# Altium schematic sheet Flash.SchDoc
size 420 x 297 mm
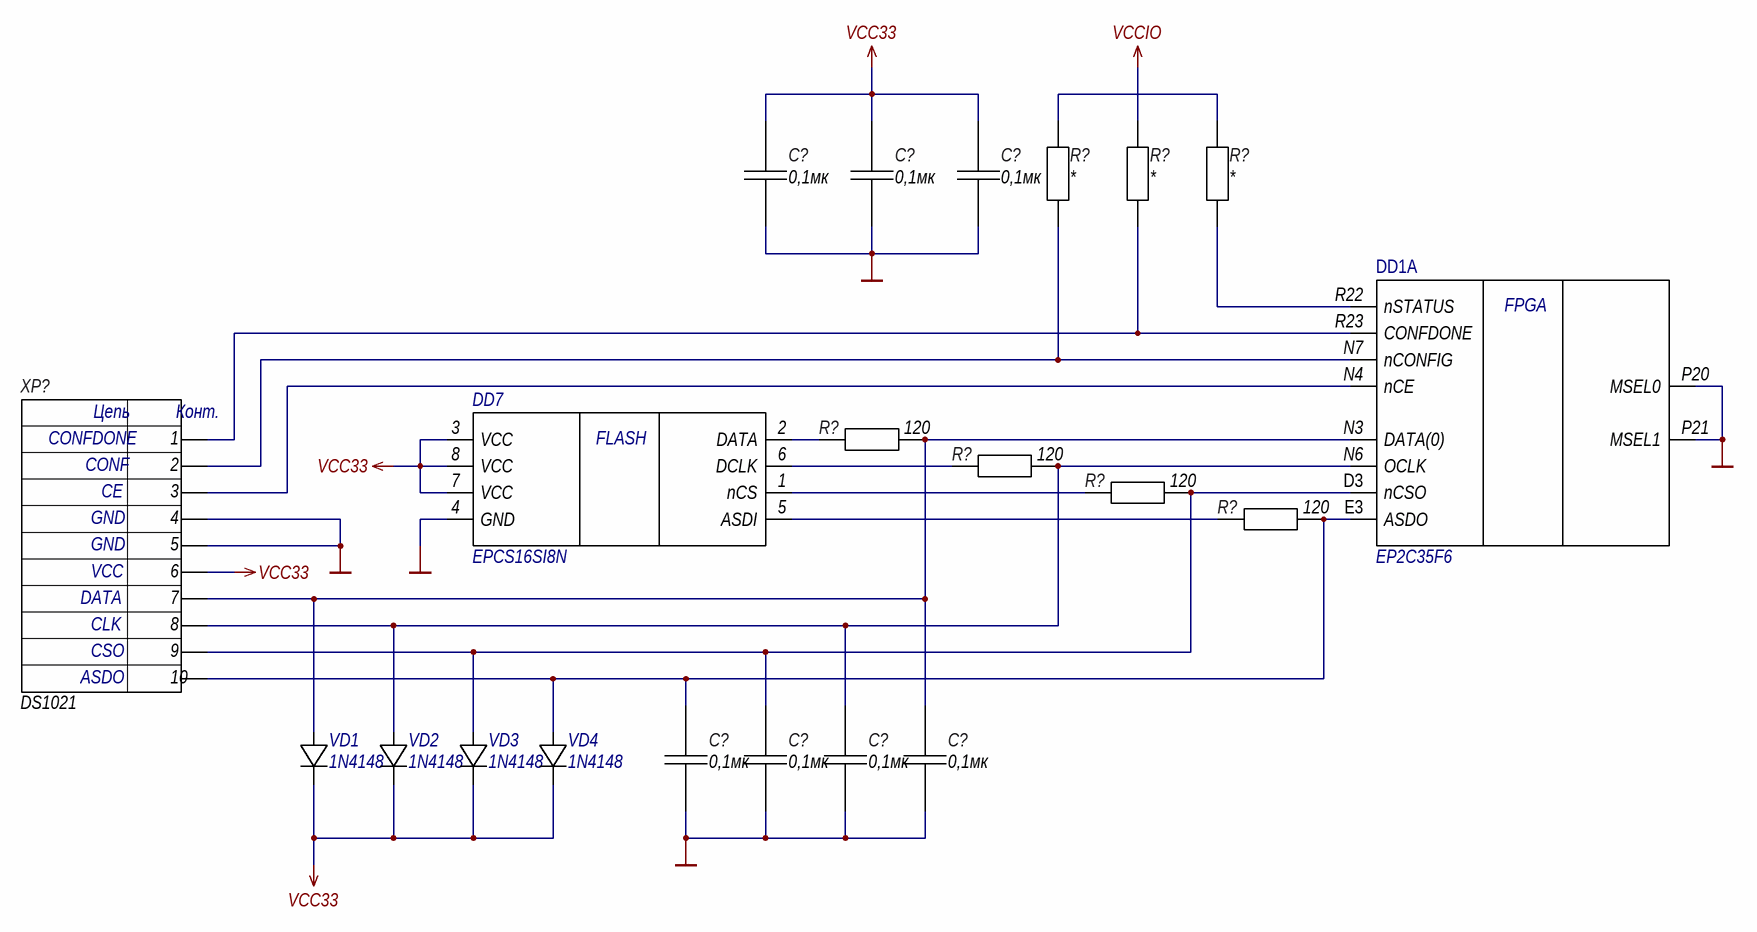
[diagram p0: Flash.SchDoc]

## Parts
(Parts that share a designator on the sheet are numbered #1, #2 ... from top to bottom, then left to right.)
C?#1  0,1мк  [ECPU1C154MA5]
C?#2  0,1мк  [ECPU1C154MA5]
C?#3  0,1мк  [ECPU1C154MA5]
C?#4  0,1мк  [ECPU1C154MA5]
C?#5  0,1мк  [ECPU1C154MA5]
C?#6  0,1мк  [ECPU1C154MA5]
C?#7  0,1мк  [ECPU1C154MA5]
DD1  EP2C35F6  [BGA672CP100_26X26_2700X2700X240B60N]  (part A of 21)
DD7  EPCS16SI8N  [SOIC127P600X175-8N]
R?#1  *  [ПТМ 0603_RES]
R?#2  *  [ПТМ 0603_RES]
R?#3  *  [ПТМ 0603_RES]
R?#4  120  [ПТМ 0603_RES]
R?#5  120  [ПТМ 0603_RES]
R?#6  120  [ПТМ 0603_RES]
R?#7  120  [ПТМ 0603_RES]
VD1  1N4148  [1N4148WVGS08]
VD2  1N4148  [1N4148WVGS08]
VD3  1N4148  [1N4148WVGS08]
VD4  1N4148  [1N4148WVGS08]
XP?  DS1021  [PBS-10]

## Nets
NetC?#1_2: C?#1.2 C?#2.2 C?#3.2 C?#4.2 C?#5.2 C?#6.2 C?#7.2 DD1.P20(MSEL0) DD1.P21(MSEL1) DD7.4(GND) XP?.4 XP?.5
VCC33: C?#1.1 C?#2.1 C?#3.1 DD7.3(VCC) DD7.7(VCC) DD7.8(VCC) VD1.1 VD2.1 VD3.1 VD4.1 XP?.6
VCCIO: R?#2.2
NetC?#4_1: C?#4.1 DD1.E3(ASDO) R?#7.2 VD4.2 XP?.10
NetC?#5_1: C?#5.1 DD1.D3(nCSO) R?#6.2 VD3.2 XP?.9
NetC?#6_1: C?#6.1 DD1.N6(OCLK) R?#5.2 VD2.2 XP?.8
NetC?#7_1: C?#7.1 DD1.N3(DATA(0)) R?#4.2 VD1.2 XP?.7
NetDD1_N4: DD1.N4(nCE) XP?.3
NetDD1_N7: DD1.N7(nCONFIG) R?#1.1 XP?.2
NetDD1_R22: DD1.R22(nSTATUS) R?#3.1
NetDD1_R23: DD1.R23(CONFDONE) R?#2.1 XP?.1
NetDD7_1: DD7.1(nCS) R?#6.1
NetDD7_2: DD7.2(DATA) R?#4.1
NetDD7_5: DD7.5(ASDI) R?#7.1
NetDD7_6: DD7.6(DCLK) R?#5.1
NetR?#1_2: R?#1.2 R?#3.2

## Notes on the sheet
- CONFDONE
- CONF
- GND
- CE
- DATA
- VCC
- ASDO
- CLK
- CSO
- Перв. примен.
- Справ. №
- Подп. и дата
- Инв. № дубл.
- Взам. инв. №
- Разраб.
- Изм.
- Лист
- № докум.
- Подп.
- Дата
- Лит.
- Масса
- Масштаб
- Пров.
- Т. контр.
- Листов
- Инв. № подл.
- Н. контр.
- Утв.
- Копировал
- Формат А3
- (in symbol Header 10x1) Цепь; Конт.
- (in symbol PLIS, part A) FPGA

## Library data of the parts
C?#1-C?#7 = Capacitor_0.1u: ValueType: Конденсатор; Value: 0,1мк; Tolerance: *; URL: *; Temp: *; Case: *; ValueManufacturer: *; ValueManufacturerPartNumber: *; ValueDescription: *; Dielectric: *; ESR: *; Voltage: *
DD1 = PLIS
DD7 = FLASH
R?#1-R?#7 = Resistor: ValueManufacturer: Yageo; ValueManufacturerPartNumber: RC0603JR-07680RL; Tolerance: 5%; Temp: -55*C..+155*C; Power: 0,1 Вт; ValueType: Резистор; Value: *; URL: *; Case: 0603; ValueDescription: *
VD1-VD4 = VD 1N41448
XP? = Header 10x1: ValueType: Разъем; Case: PBS-10